# EAGLE schematic Transceiver_Board_V_1.5 (EAGLE 9.2.2)
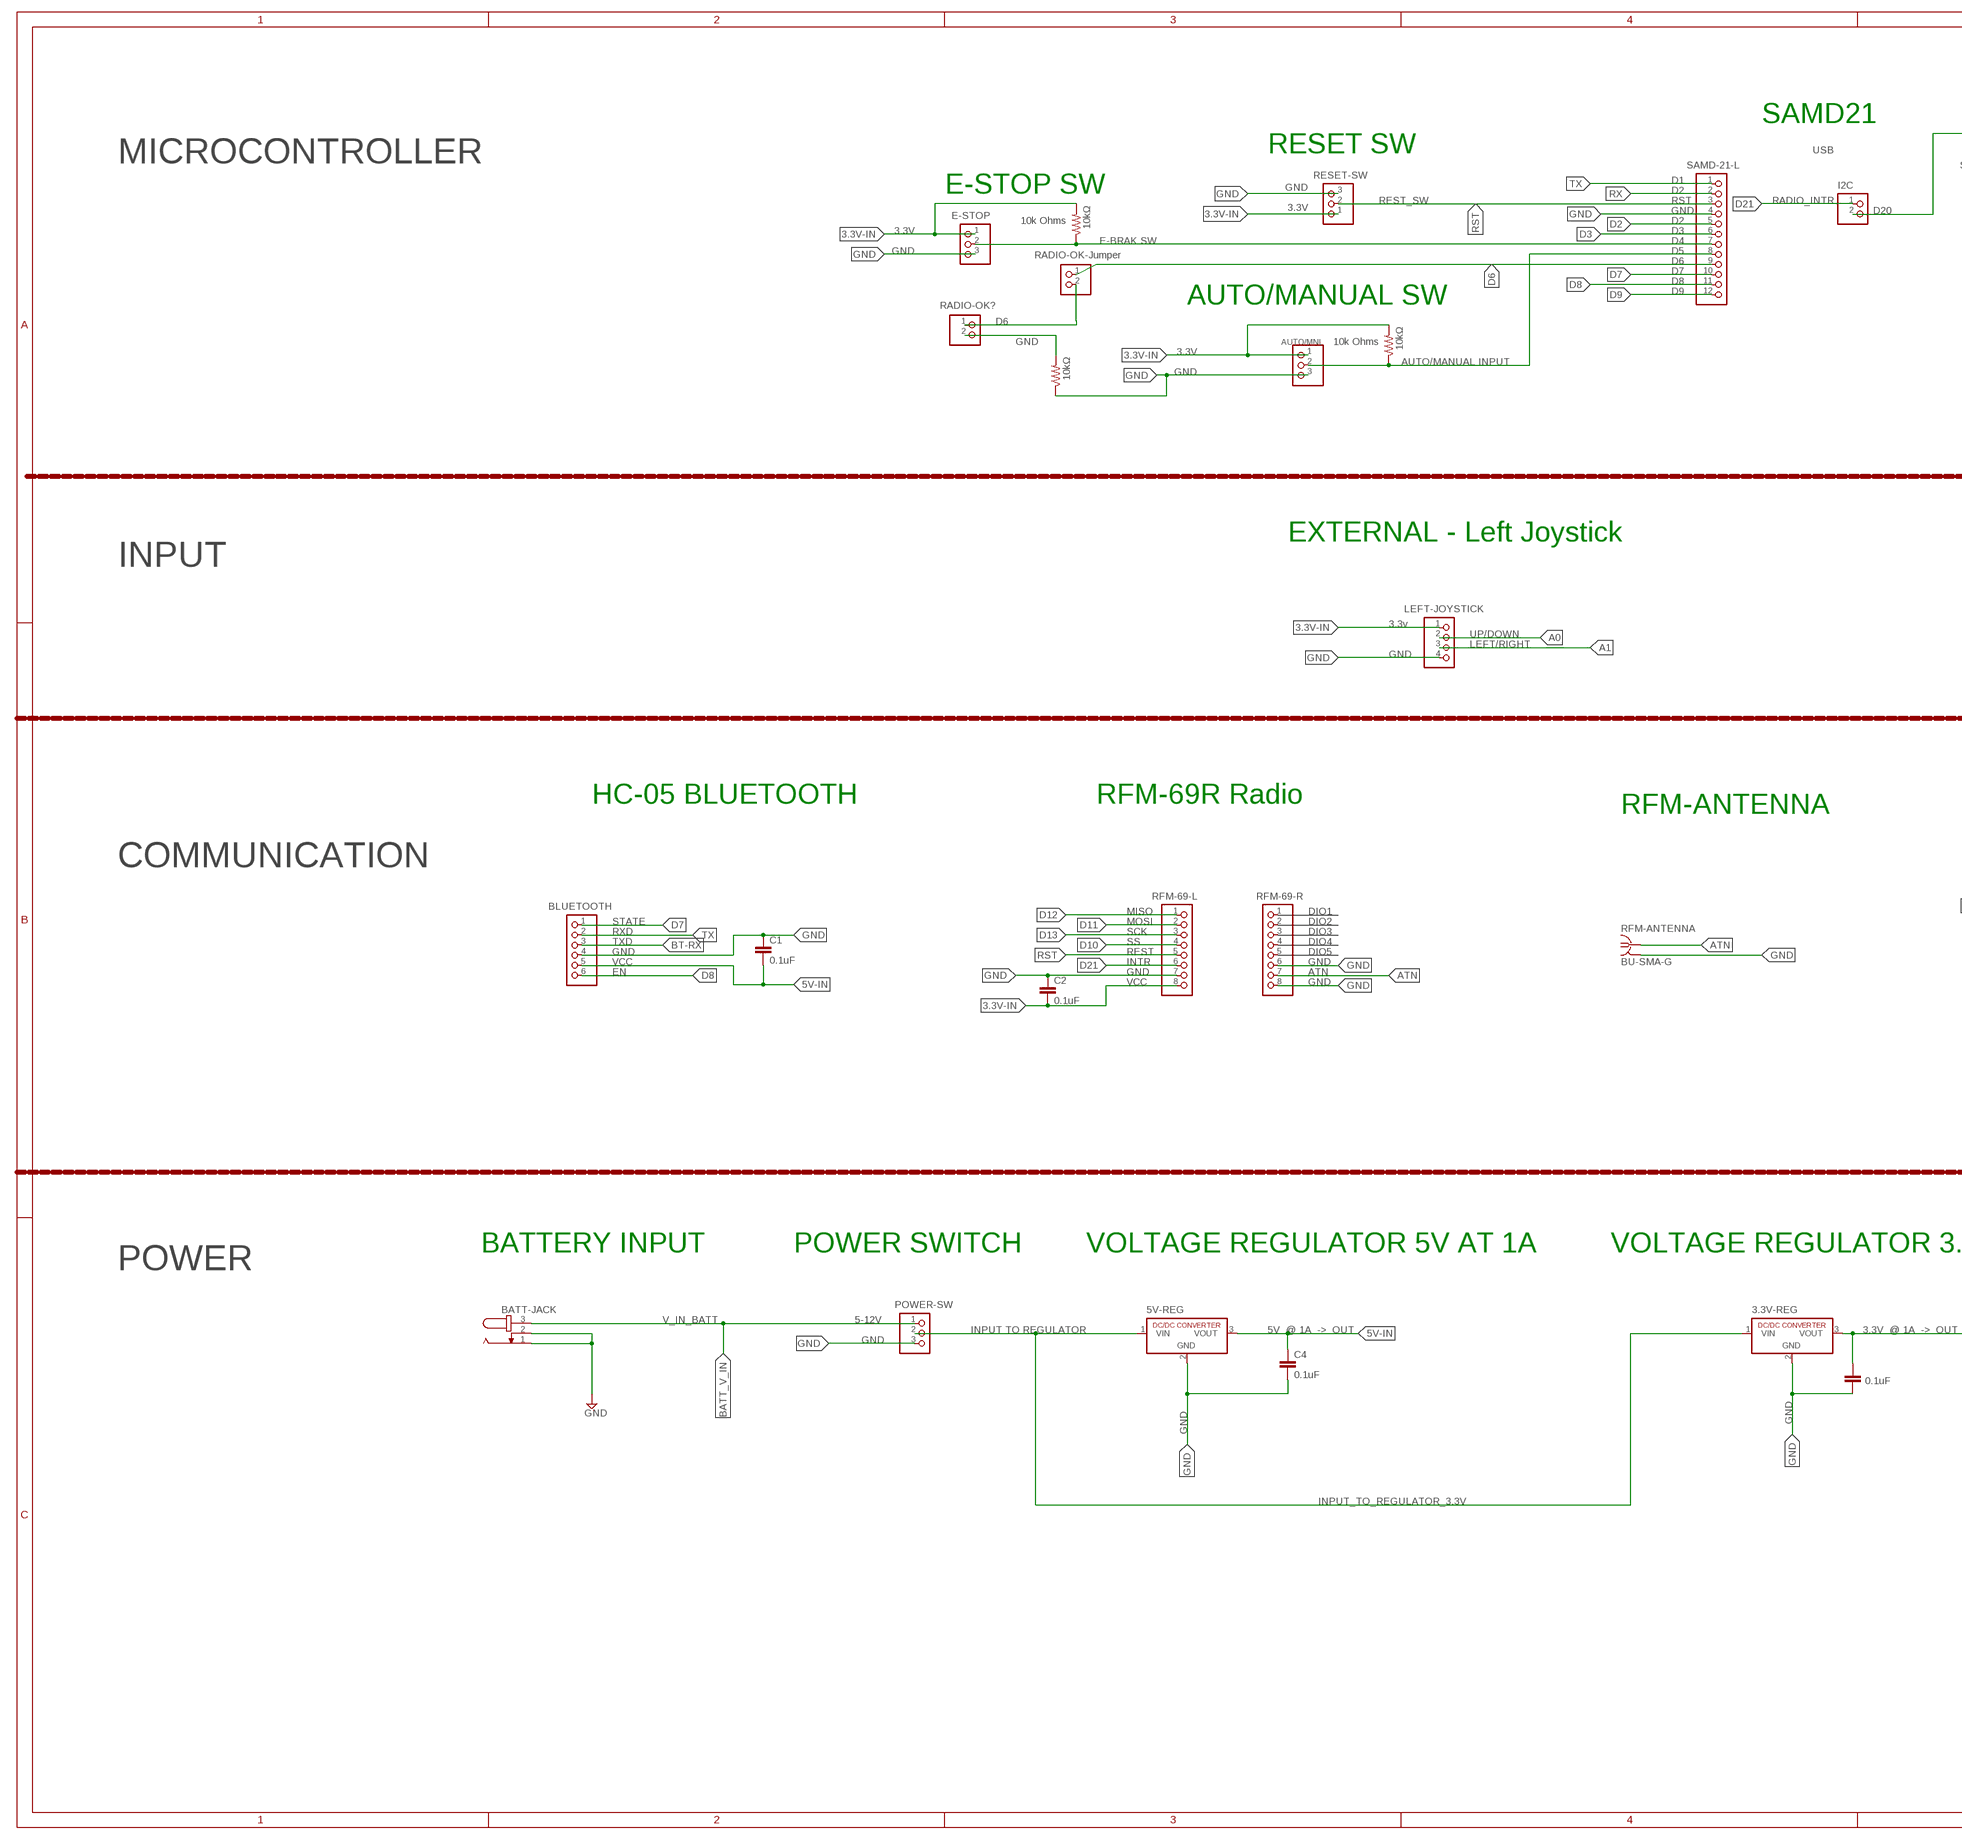
[diagram p0: schematic, sheet 1, part 1 of 2]
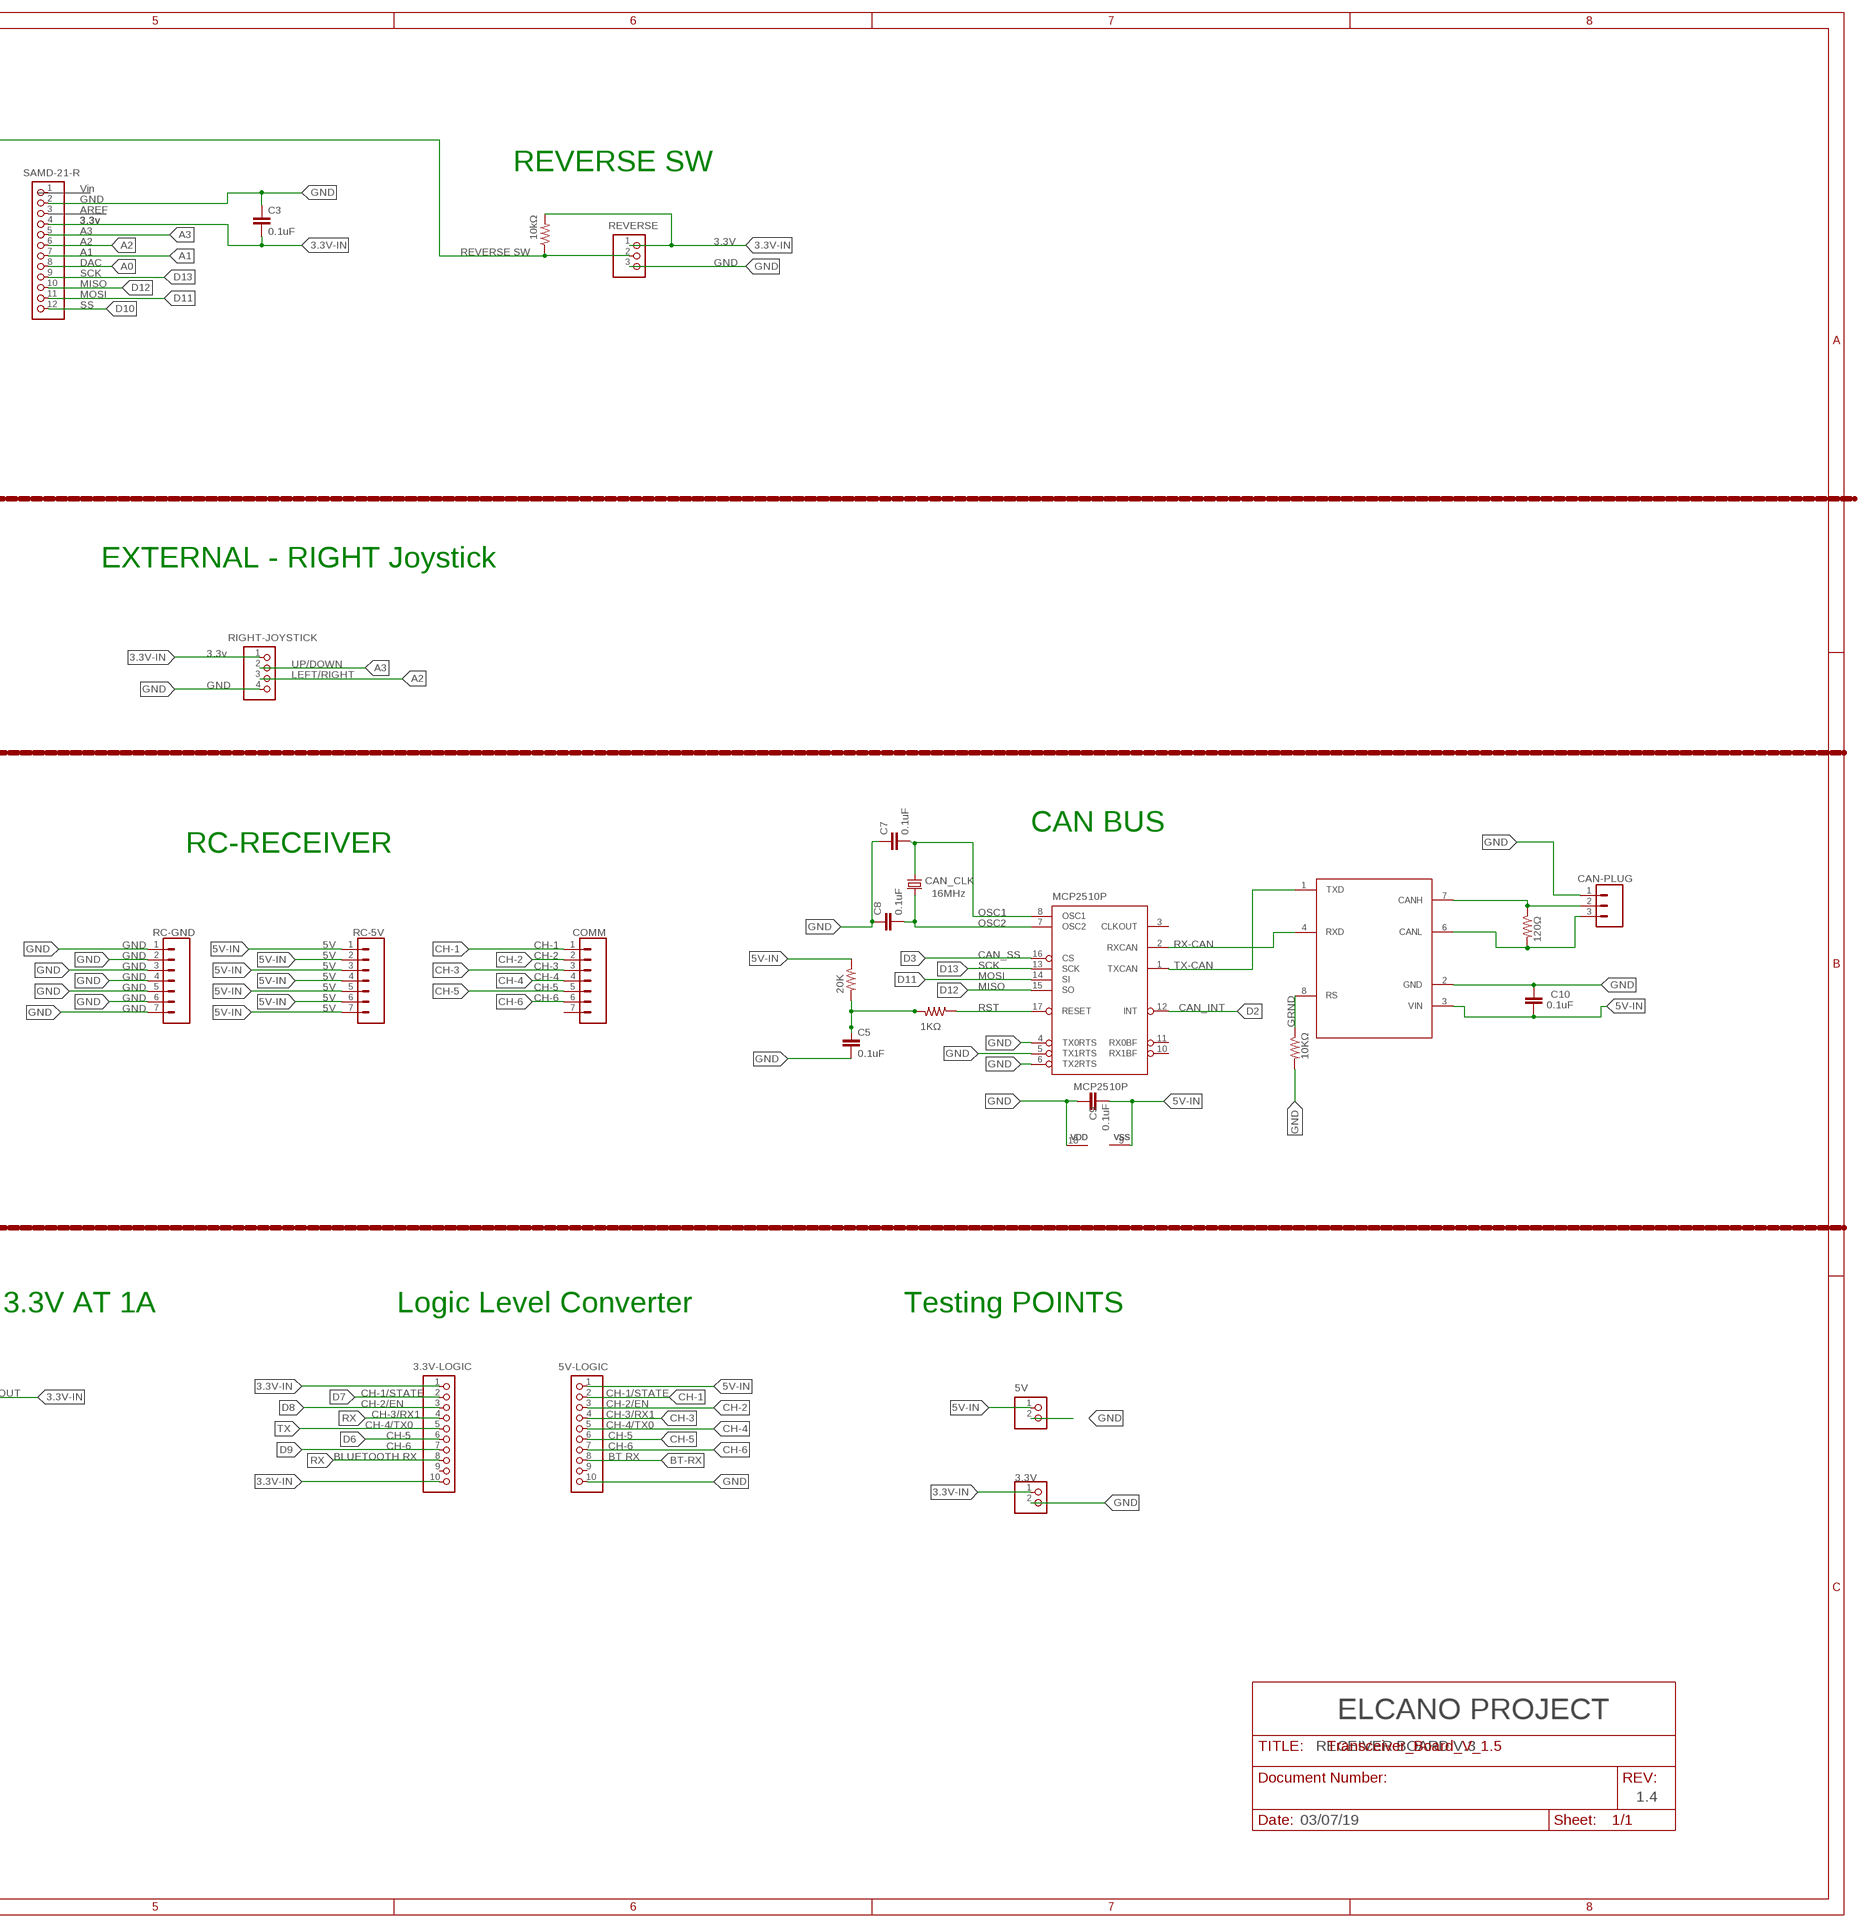
[diagram p1: schematic, sheet 1, part 2 of 2]

## Parts
3.3-LOGIC  3.3V-LOGIC  PINHD-1X10  [1X10]
3.3V-REG  3.3V REG  R-78C1.8-1.0  [SIP3]
3.3V-TEST  3.3V  PINHD-1X2  [1X02]
5V-LOGIC  5V-LOGIC  PINHD-1X10  [1X10]
5V-REG  5V REG  R-78C1.8-1.0  [SIP3]
5V-TEST  5V  PINHD-1X2  [1X02]
AT/M  AUTO/MNL  PINHD-1X3  [1X03]
BATTERY_INPUT_JACK  BATT-JACK  JACK-PLUG0  [SPC4077]
BLUETOOTH  BLUETOOTH  PINHD-1X6  [1X06]
C1  0.1uF  0.1UF-KIT-EZ-50V-20%  [CAP-PTH-SMALL-KIT]
C2  0.1uF  0.1UF-KIT-EZ-50V-20%  [CAP-PTH-SMALL-KIT]
C3  0.1uF  0.1UF-KIT-EZ-50V-20%  [CAP-PTH-SMALL-KIT]
C4  0.1uF  0.1UF-KIT-EZ-50V-20%  [CAP-PTH-SMALL-KIT]
C5  0.1uF  0.1UF-KIT-EZ-50V-20%  [CAP-PTH-SMALL-KIT]
C6  0.1uF  0.1UF-KIT-EZ-50V-20%  [CAP-PTH-SMALL-KIT]
C7  0.1uF  0.1UF-KIT-EZ-50V-20%  [CAP-PTH-SMALL-KIT]
C8  0.1uF  0.1UF-KIT-EZ-50V-20%  [CAP-PTH-SMALL-KIT]
C9  0.1uF  0.1UF-KIT-EZ-50V-20%  [CAP-PTH-SMALL-KIT]
C10  0.1uF  0.1UF-KIT-EZ-50V-20%  [CAP-PTH-SMALL-KIT]
CAN_CLK  16MHz  CRYSTAL-16MHZPTH-HC49US  [HC49US]
CAN_PLUG  CAN-PLUG  CONN_03-SCREW-5MM  [SCREWTERMINAL-5MM-3]
COMM  COMM  CONN_07  [1X07]
E-STOP  E-STOP  PINHD-1X3  [1X03]
I2C  I2C  PINHD-1X2  [1X02]
JOY-STICK-L  LEFT-JOYSTICK  PINHD-1X4  [1X04]
JOY-STICK-R  RIGHT-JOYSTICK  PINHD-1X4  [1X04]
MCP2510P  MCP2510P  [DIL18]
MCP2551  MCP2551MCP2551  [DIL08]
POWER-SW  POWER-SW  PINHD-1X3  [1X03]
R1  10kΩ  R-US_0204/7  [0204/7]
R2  10kΩ  R-US_0204/7  [0204/7]
R3  10kΩ  R-US_0204/7  [0204/7]
R5  1KΩ  R-US_0204/7  [0204/7]
R6  20K  R-US_0204/7  [0204/7]
R7  10KΩ  R-US_0204/7  [0204/7]
R8  120Ω  R-US_0204/7  [0204/7]
R9  10kΩ  R-US_0204/7  [0204/7]
RADIO-OK1  RADIO-OK-Jumper  PINHD-1X2  [1X02]
RADIO-OK?  RADIO-OK?  PINHD-1X2  [1X02]
RC-5V  RC-5V  CONN_07  [1X07]
RC-GND  RC-GND  CONN_07  [1X07]
RESET-SW  RESET-SW  PINHD-1X3  [1X03]
REVERSE  REVERSE  PINHD-1X3  [1X03]
RFM-69  RFM-69-R  PINHD-1X8  [1X08]
RFM-ANTENNA  BU-SMA-G  [BU-SMA-G]
RFM_L  RFM-69-L  PINHD-1X8  [1X08]
SAMD-21_R  SAMD-21-R  PINHD-1X12  [1X12]
SAMD_21_L  SAMD-21-L  PINHD-1X12  [1X12]

## Nets
3.3V-IN: 3.3-LOGIC.1 3.3-LOGIC.10 3.3V-REG.3(VOUT) 3.3V-TEST.1 AT/M.1 C2.2 C3.2 C6.1 E-STOP.1 JOY-STICK-L.1 JOY-STICK-R.1 R1.2 R2.2 R3.2 RESET-SW.1 REVERSE.1 RFM_L.8 SAMD-21_R.4
3.3V-IN1: C5.1 R5.2 R6.2
5V-IN: 5V-LOGIC.1 5V-REG.3(VOUT) 5V-TEST.1 BLUETOOTH.5 C1.2 C4.1 C9.2 C10.2 MCP2510P.9(VSS) MCP2551.3(VIN) R6.1 RC-5V.1 RC-5V.2 RC-5V.3 RC-5V.4 RC-5V.5 RC-5V.6 RC-5V.7
A0: JOY-STICK-L.2 SAMD-21_R.8
A1: JOY-STICK-L.3 SAMD-21_R.7
A2: JOY-STICK-R.3 SAMD-21_R.6
A3: JOY-STICK-R.2 SAMD-21_R.5
ATN: RFM-69.7 RFM-ANTENNA.1
BATT_V_IN: BATTERY_INPUT_JACK.3 POWER-SW.1
BT-RX: 5V-LOGIC.8 BLUETOOTH.3
CAN_RST: MCP2510P.17(RESET) R5.1
CANH: CAN_PLUG.2 MCP2551.7(CANH) R8.1
CANL: CAN_PLUG.3 MCP2551.6(CANL) R8.2
CH-1: 5V-LOGIC.2 COMM.1
CH-2: 5V-LOGIC.3 COMM.2
CH-3: 5V-LOGIC.4 COMM.3
CH-4: 5V-LOGIC.5 COMM.4
CH-5: 5V-LOGIC.6 COMM.5
CH-6: 5V-LOGIC.7 COMM.6
D2: MCP2510P.12(INT) SAMD_21_L.5
D3: MCP2510P.16(CS) SAMD_21_L.6
D4: E-STOP.2 R1.1 SAMD_21_L.7
D5: AT/M.2 R2.1 SAMD_21_L.8
D6: 3.3-LOGIC.6 RADIO-OK1.1 SAMD_21_L.9
D7: 3.3-LOGIC.2 BLUETOOTH.1 SAMD_21_L.10
D8: 3.3-LOGIC.3 BLUETOOTH.6 SAMD_21_L.11
D9: 3.3-LOGIC.7 SAMD_21_L.12
D10: RFM_L.4 SAMD-21_R.12
D11: MCP2510P.14(SI) RFM_L.2 SAMD-21_R.11
D12: MCP2510P.15(SO) RFM_L.1 SAMD-21_R.10
D13: MCP2510P.13(SCK) RFM_L.3 SAMD-21_R.9
D20: I2C.2 R3.1 REVERSE.2
D21: I2C.1 RFM_L.6
GND: 3.3V-REG.2(GND) 3.3V-TEST.2 5V-LOGIC.10 5V-REG.2(GND) 5V-TEST.2 AT/M.3 BATTERY_INPUT_JACK.1 BATTERY_INPUT_JACK.2 BLUETOOTH.4 C1.1 C2.1 C3.1 C4.2 C5.2 C6.2 C7.1 C8.1 C9.1 C10.1 CAN_PLUG.1 E-STOP.3 JOY-STICK-L.4 JOY-STICK-R.4 MCP2510P.4(TX0RTS) MCP2510P.5(TX1RTS) MCP2510P.6(TX2RTS) MCP2510P.18(VDD) MCP2551.2(GND) POWER-SW.3 R7.2 R9.1 R9.2 RADIO-OK?.2 RC-GND.1 RC-GND.2 RC-GND.3 RC-GND.4 RC-GND.5 RC-GND.6 RC-GND.7 RESET-SW.3 REVERSE.3 RFM-69.6 RFM-69.8 RFM-ANTENNA.2 RFM-ANTENNA.3 RFM-ANTENNA.4 RFM-ANTENNA.5 RFM_L.7 SAMD-21_R.2 SAMD_21_L.4
GRND: MCP2551.8(RS) R7.1
INPUT_TO_REGULATOR_3.3V: 3.3V-REG.1(VIN) 5V-REG.1(VIN) POWER-SW.2
N$1: RADIO-OK1.2 RADIO-OK?.1
OSC1: C7.2 CAN_CLK.1 MCP2510P.8(OSC1)
OSC2: C8.2 CAN_CLK.2 MCP2510P.7(OSC2)
RST: RESET-SW.2 RFM_L.5 SAMD_21_L.3
RX: 3.3-LOGIC.4 3.3-LOGIC.8 SAMD_21_L.2
RX-CAN: MCP2510P.2(RXCAN) MCP2551.4(RXD)
TX: 3.3-LOGIC.5 BLUETOOTH.2 SAMD_21_L.1
TX-CAN: MCP2510P.1(TXCAN) MCP2551.1(TXD)
Unconnected: 3.3-LOGIC.9 5V-LOGIC.9 COMM.7 MCP2510P.3(CLKOUT) MCP2510P.10(RX1BF) MCP2510P.11(RX0BF) RFM-69.1 RFM-69.2 RFM-69.3 RFM-69.4 RFM-69.5 SAMD-21_R.1 SAMD-21_R.3

## Notes on the sheet
- SAMD21
- RESET SW | USB
- MICROCONTROLLER | REVERSE SW
- GND | D1 | Vin
- E-STOP SW | D2 | GND
- 3.3V | REST_SW | RST | RADIO_INTR | AREF
- GND | D20 | 3.3v | 3.3v
- 10k Ohms | D2 | A3
- 3.3V | D3 | A2 | 3.3V
- E-BRAK SW | D4 | A1 | REVERSE SW
- GND | D5 | DAC | GND
- D6 | SCK
- D7 | MISO
- D8 | MOSI
- D9 | SS
- AUTO/MANUAL SW
- D6
- 10k Ohms
- 3.3V
- AUTO/MANUAL INPUT
- GND
- EXTERNAL - Left Joystick | EXTERNAL - RIGHT Joystick
- INPUT
- 3.3v | 3.3v
- UP/DOWN | UP/DOWN
- LEFT/RIGHT | LEFT/RIGHT
- GND | GND
- CAN BUS
- HC-05 BLUETOOTH | RFM-69R Radio
- RFM-ANTENNA | RC-RECEIVER
- COMMUNICATION
- OSC1
- OSC2
- GND | 5V | CH-1 | RX-CAN
- MISO | DIO1 | GND | 5V | CH-2 | CAN_SS
- STATE | MOSI | DIO2 | GND | 5V | CH-3 | SCK | TX-CAN
- RXD | SCK | DIO3 | GND | 5V | CH-4 | MOSI
- TXD | SS | DIO4 | GND | 5V | CH-5 | MISO
- GND | REST | DIO5 | GND | 5V | CH-6
- VCC | INTR | GND | GND | 5V | RST | CAN_INT
- EN | GND | ATN
- VCC | GND
- BATTERY INPUT | POWER SWITCH | VOLTAGE REGULATOR 5V AT 1A | VOLTAGE REGULATOR 3.3V AT 1A | Logic Level Converter | Testing POINTS
- POWER
- V_IN_BATT | 5-12V
- INPUT TO REGULATOR | 5V  @ 1A  ->  OUT | 3.3V  @ 1A  ->  OUT | CH-1/STATE | CH-1/STATE
- GND | CH-2/EN | CH-2/EN
- CH-3/RX1 | CH-3/RX1
- CH-4/TX0 | CH-4/TX0
- CH-5 | CH-5
- CH-6 | CH-6
- BLUETOOTH RX | BT RX
- GND
- GND
- ELCANO PROJECT
- RECEIVER BOARD V.3
- 1.4
- 03/07/19

## Library data of the parts
3.3-LOGIC 5V-LOGIC = pinhead:PINHD-1X10: PIN HEADER
3.3V-REG 5V-REG = dc-dc-converter:R-78C*-1.0: INNOLINE DC/DC-Converter 1.0 AMP SIP3 Single Output Source: Data sheet <http://www.mikrocontroller.net/attachment/150645/157764-da-01-en-DC_DC_WANDLER_R_78C5_0_1_0.pdf>
3.3V-TEST 5V-TEST I2C RADIO-OK1 RADIO-OK? = pinhead:PINHD-1X2: PIN HEADER
AT/M E-STOP POWER-SW RESET-SW REVERSE = pinhead:PINHD-1X3: PIN HEADER
BATTERY_INPUT_JACK = con-jack:JACK-PLUG: DC POWER JACK Power Jack, DC, Right Angle, Through Hole, Rated 5A at 16VDC, PC Terminals Distributor: Farnell (www.Farnell.de) Drawing: 84N1161.pdf / 84N1162.pdf Manufacturer: SPC Technology (www.spctechnology.com) Type: SPC4077 / SPC 4078; OC_FARNELL: unknown; OC_NEWARK: unknown
BLUETOOTH = pinhead:PINHD-1X6: PIN HEADER
C1-C10 = SparkFun-Capacitors:0.1UF: 0.1µF ceramic capacitors A capacitor is a passive two-terminal electrical component used to store electrical energy temporarily in an electric field.; PROD_ID: CAP-08370
CAN_CLK = SparkFun-Clocks:CRYSTAL-16MHZ: 16MHz Crystal Digikey Example <http://www.digikey.com/product-search/en?keywords=535-9122-1-ND> Frequency: 16MHz Frequency Stability: ±50ppm Frequency Tolerance: ±20ppm Load Capacitance: 18pF SparkFun Products: Pro Micro -5V/16MHz <https://www.sparkfun.com/products/12640> SparkFun Serial Enabled LCD Kit <https://www.sparkfun.com/products/10097>; PROD_ID: XTAL-08181; SF_ID: COM-00536
CAN_PLUG = SparkFun-Connectors:CONN_03: Multi connection point. Often used as Generic Header-pin footprint for 0.1 inch spaced/style header connections On any of the 0.1 inch spaced packages, you can populate with these: Break Away Headers - Straight <https://www.sparkfun.com/products/116> (PRT-00116) Break Away Male Headers - Right Angle <https://www.sparkfun.com/products/553> (PRT-00553) Female Headers <https://www.sparkfun.com/products/115> (PRT-00115) Break Away Headers - Machine Pin <https://www.sparkfun.com/products/117> (PRT-00117) Break Away Female Headers - Swiss Machine Pin <https://www.sparkfun.com/products/743> (PRT-00743) Stackable Header - 3 Pin (Female, 0.1") <https://www.sparkfun.com/products/13875> (PRT-13875) For SCREWTERMINALS and SPRING TERMINALS visit here: Screw Terimnals on SparkFun.com <https://www.sparkfun.com/search/results?term=Screw+Terminals> (5mm/3.5mm/2.54mm spacing) This device is also useful as a general connection point to wire up your design to another part of your project. Our various solder wires solder well into these plated through hole pads. Hook-Up Wire - Assortment (Stranded, 22 AWG) <https://www.sparkfun.com/products/11375> (PRT-11375) Hook-Up Wire - Assortment (Solid Core, 22 AWG) <https://www.sparkfun.com/products/11367> (PRT-11367) View the entire wire category on our website here <https://www.sparkfun.com/categories/141> Special notes: Molex polarized connector foot print use with SKU : PRT-08232 with associated crimp pins and housings.; PROD_ID: CONN-10134; SF_SKU: PRT-08433
COMM RC-5V RC-GND = SparkFun-Connectors:CONN_07: Multi connection point. Often used as Generic Header-pin footprint for 0.1 inch spaced/style header connections On any of the 0.1 inch spaced packages, you can populate with these: Break Away Headers - Straight <https://www.sparkfun.com/products/116> (PRT-00116) Break Away Male Headers - Right Angle <https://www.sparkfun.com/products/553> (PRT-00553) Female Headers <https://www.sparkfun.com/products/115> (PRT-00115) Break Away Headers - Machine Pin <https://www.sparkfun.com/products/117> (PRT-00117) Break Away Female Headers - Swiss Machine Pin <https://www.sparkfun.com/products/743> (PRT-00743) For SCREWTERMINALS and SPRING TERMINALS visit here: Screw Terimnals on SparkFun.com <https://www.sparkfun.com/search/results?term=Screw+Terminals> (5mm/3.5mm/2.54mm spacing) This device is also useful as a general connection point to wire up your design to another part of your project. Our various solder wires solder well into these plated through hole pads. Hook-Up Wire - Assortment (Stranded, 22 AWG) <https://www.sparkfun.com/products/11375> (PRT-11375) Hook-Up Wire - Assortment (Solid Core, 22 AWG) <https://www.sparkfun.com/products/11367> (PRT-11367) View the entire wire category on our website here <https://www.sparkfun.com/categories/141> Special notes: Molex polarized connector foot print use with SKU : PRT-08231 with associated crimp pins and housings. 1MM SMD Version SKU: PRT-10208 NOTES ON THE VARIANTS LOCK and LOCK_LONGPADS... This footprint was designed to help hold the alignment of a through-hole component (i.e. 6-pin header) while soldering it into place. You may notice that each hole has been shifted either up or down by 0.005 of an inch from it's more standard position (which is a perfectly straight line). This slight alteration caused the pins (the squares in the middle) to touch the edges of the holes. Because they are alternating, it causes a "brace" to hold the component in place. 0.005 has proven to be the perfect amount of "off-center" position when using our standard breakaway headers. Although looks a little odd when you look at the bare footprint, once you have a header in there, the alteration is very hard to notice. Also,if you push a header all the way into place, it is covered up entirely on the bottom side.
JOY-STICK-L JOY-STICK-R = pinhead:PINHD-1X4: PIN HEADER
MCP2510P = microchip_can:MCP2510
MCP2551 = MCP2551:MCP2551
R1-R3 R5-R9 = rcl:R-US_: RESISTOR, American symbol; SPICEPREFIX: R
RFM-69 RFM_L = pinhead:PINHD-1X8: PIN HEADER
RFM-ANTENNA = con-coax:BU-SMA-G: FEMALE SMA CONNECTOR Radiall distributor RS 193-9117; OC_FARNELL: unknown; OC_NEWARK: unknown
SAMD-21_R SAMD_21_L = pinhead:PINHD-1X12: PIN HEADER